# Altium project ADCAN.PrjPcb (part 1 of 3)
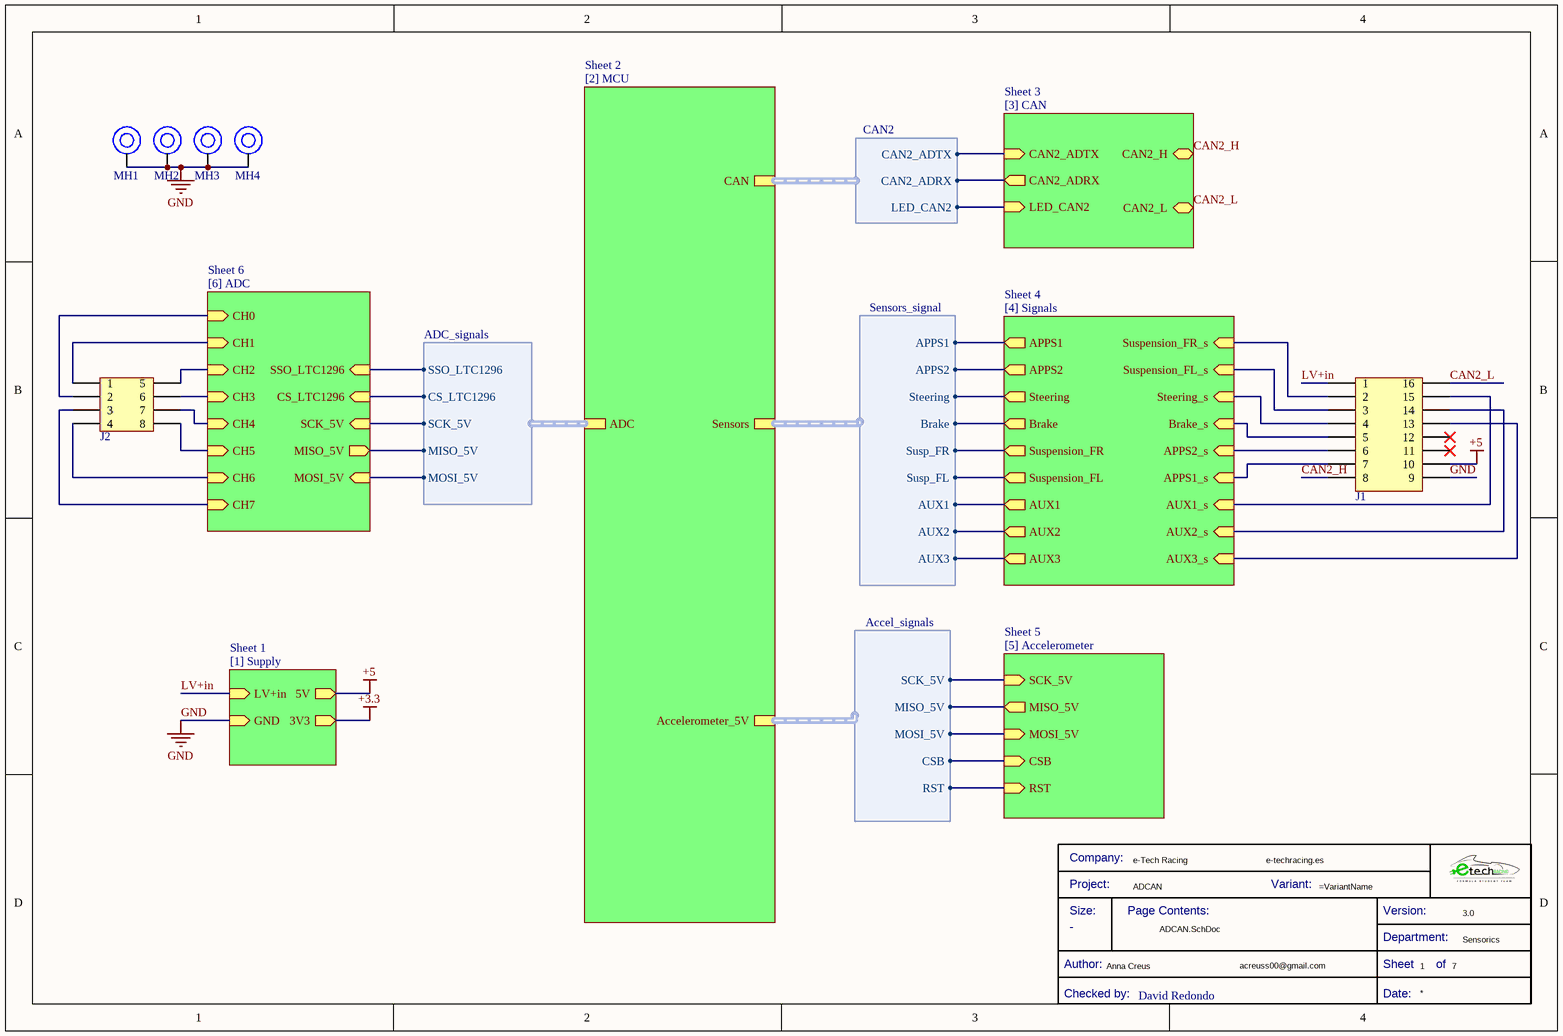
[diagram p0: ADCAN.SchDoc]
Company: e-Tech Racing; Department: Sensorics; DesignedByURL: e-techracing.es; DesignerMail: acreuss00@gmail.com; DesignerName: Anna Creus; Project: ADCAN; ReviewerName: David Redondo; Version: 3.0
7 sheets, 155 parts. Net scope: hierarchical (ports join the sheet entries above them; power ports are global).
Board file: ADCAN.PcbDoc
Sheets:
  ADCAN.SchDoc
    Sheet 2 = [2] MCU.SchDoc
    Sheet 1 = [1] Supply.SchDoc
    Sheet 3 = [3] CAN.SchDoc
    Sheet 4 = [4] Signals.SchDoc
    Sheet 5 = [5] Accelerometer.SchDoc
    Sheet 6 = [6] ADC.SchDoc

## Sheet ADCAN.SchDoc
size A4; DocumentNumber: 0; SheetNumber: 1; SheetTotal: 7

### Parts
(Parts that share a designator on the sheet are numbered #1, #2 ... from top to bottom, then left to right.)
*#1  Checked by:: David Redondo  (hidden comment: Title Block_template)  (graphical)
J1  1053141116  [J_NanoFit_2x8]  (value not drawn)
J2  105314-1108  [J_NanoFit_2X4]  (value not drawn)
MH1  Mounting_Hole_M3  [Mounting_Hole_M3]  (value not drawn)
MH2  Mounting_Hole_M3  [Mounting_Hole_M3]  (value not drawn)
MH3  Mounting_Hole_M3  [Mounting_Hole_M3]  (value not drawn)
MH4  Mounting_Hole_M3  [Mounting_Hole_M3]  (value not drawn)

### Sub-sheets
Sheet 1 = [1] Supply: 5V (out), 3V3 (out), LV+in (in), GND (in)
Sheet 2 = [2] MCU: CAN (harness CAN2), Sensors (harness Sensors_signal), Accelerometer_5V (harness Accel_signals), ADC (harness ADC_signals)
Sheet 3 = [3] CAN: CAN2_ADTX (in), CAN2_ADRX (out), LED_CAN2 (in), CAN2_H (bidir), CAN2_L (bidir)
Sheet 4 = [4] Signals: APPS1 (out), APPS2 (out), Steering (out), Brake (out), Suspension_FR (out), Suspension_FL (out), APPS1_s (in), APPS2_s (in), Brake_s (in), Steering_s (in), Suspension_FL_s (in), Suspension_FR_s (in), AUX1 (out), AUX2 (out), AUX1_s (in), AUX2_s (in), AUX3 (out), AUX3_s (in)
Sheet 5 = [5] Accelerometer: SCK_5V (in), MISO_5V (out), MOSI_5V (in), CSB (in), RST (in)
Sheet 6 = [6] ADC: SSO_LTC1296 (in), SCK_5V (in), CS_LTC1296 (in), CH0 (in), CH1 (in), CH2 (in), CH3 (in), CH4 (in), CH5 (in), CH6 (in), CH7 (in), MISO_5V (out), MOSI_5V (in)

### Harnesses
CAN2: CAN2_ADTX, CAN2_ADRX, LED_CAN2
Sensors_signal: APPS1, APPS2, Steering, Brake, Susp_FR, Susp_FL, AUX1, AUX2, AUX3
Accel_signals: SCK_5V, MISO_5V, MOSI_5V, CSB, RST
ADC_signals: SSO_LTC1296, CS_LTC1296, SCK_5V, MISO_5V, MOSI_5V

### Nets
+5: J1.10 ; sheet Sheet 1/5V
GND: J1.9 MH1.1 MH2.1 MH3.1 MH4.1 ; sheet Sheet 1/GND
APPS1: sheet Sheet 4/APPS1, sheet Sheet 2/Sensors.APPS1
APPS1_s: J1.7 ; sheet Sheet 4/APPS1_s
APPS2: sheet Sheet 4/APPS2, sheet Sheet 2/Sensors.APPS2
APPS2_s: J1.6 ; sheet Sheet 4/APPS2_s
AUX1: sheet Sheet 4/AUX1, sheet Sheet 2/Sensors.AUX1
AUX1_s: J1.15 ; sheet Sheet 4/AUX1_s
AUX2: sheet Sheet 4/AUX2, sheet Sheet 2/Sensors.AUX2
AUX2_s: J1.14 ; sheet Sheet 4/AUX2_s
AUX3: sheet Sheet 4/AUX3, sheet Sheet 2/Sensors.AUX3
AUX3_s: J1.13 ; sheet Sheet 4/AUX3_s
Brake: sheet Sheet 4/Brake, sheet Sheet 2/Sensors.Brake
Brake_s: J1.5 ; sheet Sheet 4/Brake_s
CAN2_ADRX: sheet Sheet 3/CAN2_ADRX, sheet Sheet 2/CAN.CAN2_ADRX
CAN2_ADTX: sheet Sheet 3/CAN2_ADTX, sheet Sheet 2/CAN.CAN2_ADTX
CAN2_H: J1.8 ; sheet Sheet 3/CAN2_H
CAN2_L: J1.16 ; sheet Sheet 3/CAN2_L
CS_LTC1296: sheet Sheet 6/CS_LTC1296, sheet Sheet 2/ADC.CS_LTC1296
CSB: sheet Sheet 5/CSB, sheet Sheet 2/Accelerometer_5V.CSB
LED_CAN2: sheet Sheet 3/LED_CAN2, sheet Sheet 2/CAN.LED_CAN2
LV+in: J1.1 ; sheet Sheet 1/LV+in
MISO_5V: sheet Sheet 5/MISO_5V, sheet Sheet 6/MISO_5V, sheet Sheet 2/Accelerometer_5V.MISO_5V, sheet Sheet 2/ADC.MISO_5V
MOSI_5V: sheet Sheet 5/MOSI_5V, sheet Sheet 6/MOSI_5V, sheet Sheet 2/Accelerometer_5V.MOSI_5V, sheet Sheet 2/ADC.MOSI_5V
RST: sheet Sheet 5/RST, sheet Sheet 2/Accelerometer_5V.RST
SCK_5V: sheet Sheet 5/SCK_5V, sheet Sheet 6/SCK_5V, sheet Sheet 2/Accelerometer_5V.SCK_5V, sheet Sheet 2/ADC.SCK_5V
SSO_LTC1296: sheet Sheet 6/SSO_LTC1296, sheet Sheet 2/ADC.SSO_LTC1296
Steering: sheet Sheet 4/Steering, sheet Sheet 2/Sensors.Steering
Steering_s: J1.4 ; sheet Sheet 4/Steering_s
SuspeFL_s: J1.3 ; sheet Sheet 4/Suspension_FL_s
SuspeFR_s: J1.2 ; sheet Sheet 4/Suspension_FR_s
Suspension_FL: sheet Sheet 4/Suspension_FL, sheet Sheet 2/Sensors.Susp_FL
Suspension_FR: sheet Sheet 4/Suspension_FR, sheet Sheet 2/Sensors.Susp_FR
NetJ2_1: J2.1 ; sheet Sheet 6/CH1
NetJ2_2: J2.2 ; sheet Sheet 6/CH0
NetJ2_3: J2.3 ; sheet Sheet 6/CH7
NetJ2_4: J2.4 ; sheet Sheet 6/CH6
NetJ2_5: J2.5 ; sheet Sheet 6/CH2
NetJ2_6: J2.6 ; sheet Sheet 6/CH3
NetJ2_7: J2.7 ; sheet Sheet 6/CH4
NetJ2_8: J2.8 ; sheet Sheet 6/CH5

Not connected (* = marked no-connect by the designer): J1 11* 12*

### Notes on the sheet
- (in symbol Title Block_template) Company:; Project:; Variant:; Size:; Page Contents:; Version:; Department:; Author:; Sheet; of; Checked by:; Date:

### Library data of the parts
*#1 = Title Block_template: Standard Title Block; .Creator: GP; Category: Title Block; .PCBcheck: GP; .SCHcheck: GP; Size: -
J1 = J_NanoFit_2x8: Nano-Fit Right Angle Header Through Hole 2.50mm Pitch Dual Row 16 Circuits Tin (Sn) Plating Black; Manufacturer: Molex; Manufacturer Part Number: 105314-1116; .Creator: DO; ComponentLink1URL: https://www.molex.com/pdm_docs/ps/PS-105300-100-001.pdf?src-supplier=Digi-Key; ComponentLink1Description: https://www.molex.com/pdm_docs/ps/PS-105300-100-001.pdf?src-supplier=Digi-Key; ComponentLink2Description: Where buy it; ComponentLink2URL: https://www.molex.com/molex/products/part-detail/pcb_headers/1053141116; Supplier 1: Newark; RoHS: Yes; Category: Headers and Wire Housings; Stock 1: 366; Pricing 1: 1=3,37000, 10=3,24000, 25=2,88000, 50=2,81000, 100=2,73000, 250=2,44000 (USD); Supplier Part Number 1: 33AC7692
J2 = J_NanoFit_2x4: Nano-Fit Right Angle Header Through Hole 2.50mm Pitch Dual Row 8 Circuits Tin (Sn) Plating Black; Manufacturer: Molex; Temperature rating: -40° to +105°C; Category type: PCB header; Maximum current: 7.5 A; Maximum voltage: 750 V AC; Connections: 2x4; Connector Type: Header,Male Pin; Number of Positions: 8; .Creator: DO; Category: Connector; ComponentLink1Description: Datasheet; ComponentLink1URL: https://www.molex.com/molex/products/part-detail/pcb_headers/1053141104; ComponentLink2Description: Where buy it; ComponentLink2URL: *; Manufacturer part number: 105314-1108; Supplier: *; RoHS: *; Application: Wire to board; Product name: Nano-Fit; Flammability: 94V-0; Orientation: Right Angle; Mount: Through hole; Supplier 1: Digi-Key; Stock 1: 11021; Pricing 1: 1=1,98000, 10=1,68600, 156=1,39308, 1092=1,09983, 4992=0,97518, 10140=0,95318 (USD); Contact Plating: Tin; Contact Material: Brass; Contact Shape: Square; Insulation Material: Polymer; Insulation Color: Black; Min Operating Temperature: -40°C; Max Operating Temperature: 105°C; Fastening Type: Latch; Packaging: Tray; Number of Rows: 2; Termination: Solder; RoHS Compliant: Yes; ComponentLink3URL: http://www.farnell.com/datasheets/2551096.pdf?src-supplier=Newark; ComponentLink3Description: http://www.farnell.com/datasheets/2551096.pdf?src-supplier=Newark; ComponentLink4URL: https://www.molex.com/pdm_docs/sd/1053141104_sd.pdf?src-supplier=Digi-Key; ComponentLink4Description: https://www.molex.com/pdm_docs/sd/1053141104_sd.pdf?src-supplier=Digi-Key; Supplier Part Number 1: WM16909-ND

## Sheet [2] MCU.SchDoc
size A4; SheetNumber: 3; SheetTotal: 6
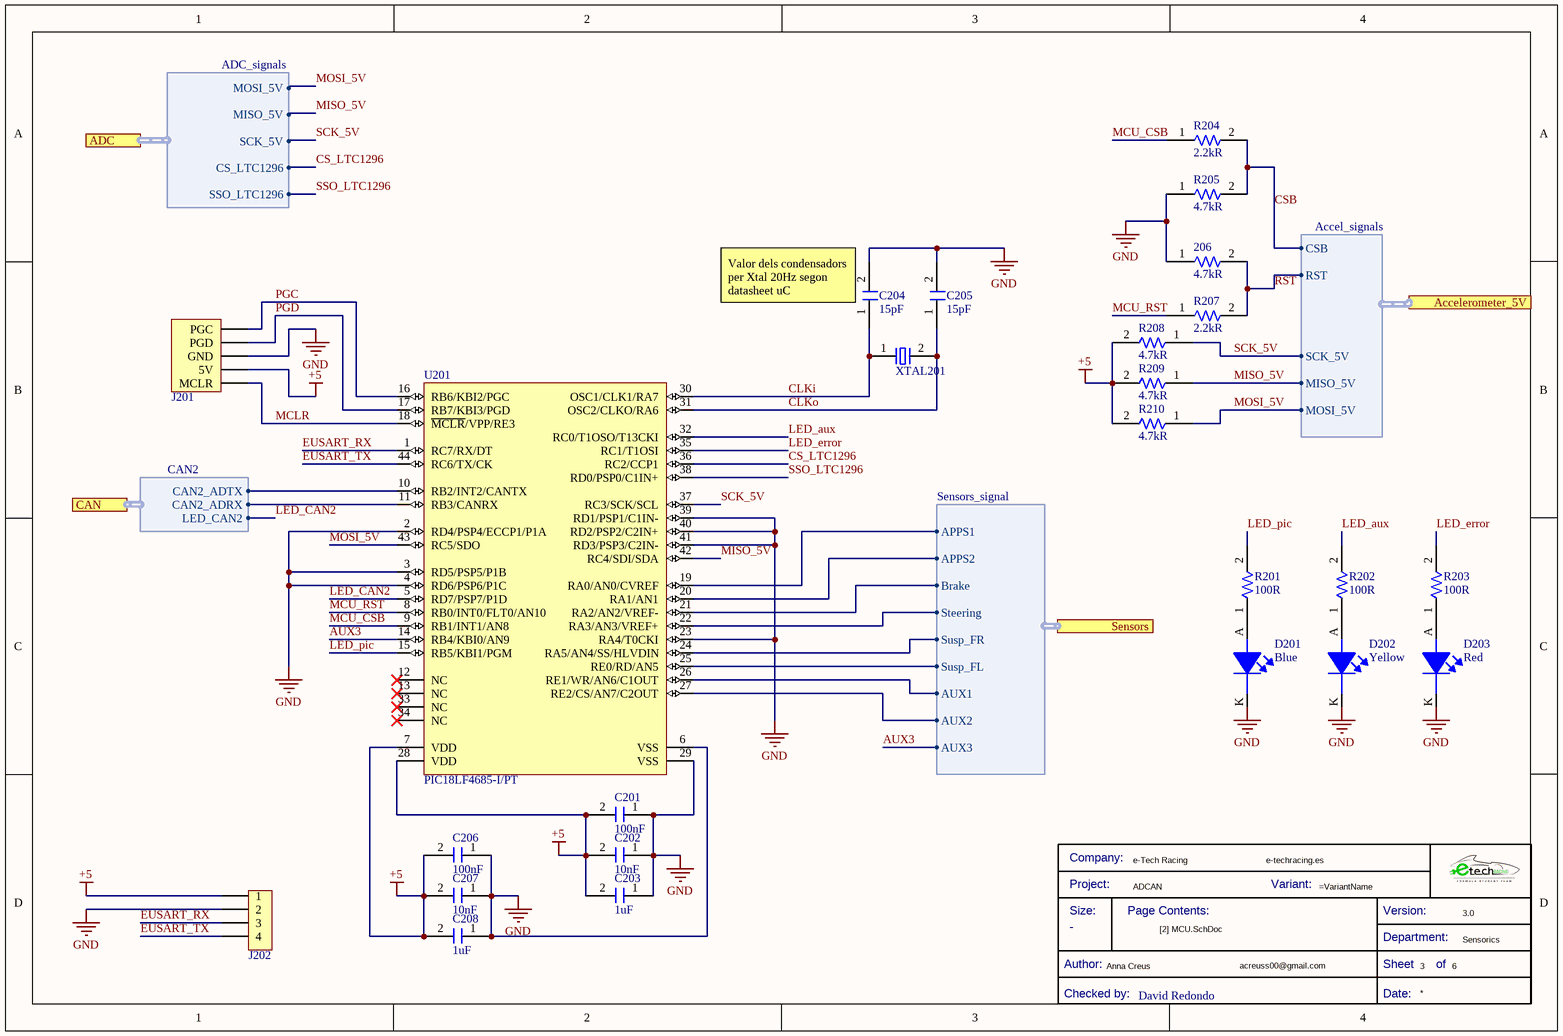
[diagram p1: [2] MCU.SchDoc]

### Parts
(Parts that share a designator on the sheet are numbered #1, #2 ... from top to bottom, then left to right.)
206  Resistance: 4.7kR  [R1206FTK-W]  (hidden comment: CRS1206-FX-4701ELF)
*#2  Checked by:: David Redondo  (hidden comment: Title Block_template)  (graphical)
C201  Capacitance: 100nF  [C1206FNPC-RW]  (hidden comment: 885012208009)
C202  Capacitance: 10nF  [C1206FNPC-RW]  (hidden comment: 885012208009)
C203  Capacitance: 1uF  [C1206FNPC-RW]  (hidden comment: 885012208009)
C204  Capacitance: 15pF  [C1206FNPC-RW]  (hidden comment: 885012008038)
C205  Capacitance: 15pF  [C1206FNPC-RW]  (hidden comment: 885012008038)
C206  Capacitance: 100nF  [C1206FNPC-RW]  (hidden comment: 885012208009)
C207  Capacitance: 10nF  [C1206FNPC-RW]  (hidden comment: 885012208009)
C208  Capacitance: 1uF  [C1206FNPC-RW]  (hidden comment: 885012208009)
D201  Color: Blue  [LED_1206_WE]  (hidden comment: 150120BS75000)
D202  Color: Yellow  [LED_1206_WE]  (hidden comment: 150120YS75000)
D203  Color: Red  [LED_1206_WE]  (hidden comment: 150120RS75000)
J201  61300511121  [J_Pinheader_1x5]  (value not drawn)
J202  61300411121  [J_PinHeader_1x4]  (value not drawn)
R201  Resistance: 100R  [R1206FTK-W]  (hidden comment: CRG1206F100R)
R202  Resistance: 100R  [R1206FTK-W]  (hidden comment: CRG1206F100R)
R203  Resistance: 100R  [R1206FTK-W]  (hidden comment: CRG1206F100R)
R204  Resistance: 2.2kR  [R1206FTK-W]  (hidden comment: CR1206-FX-2201ELF)
R205  Resistance: 4.7kR  [R1206FTK-W]  (hidden comment: CRS1206-FX-4701ELF)
R207  Resistance: 2.2kR  [R1206FTK-W]  (hidden comment: CR1206-FX-2201ELF)
R208  Resistance: 4.7kR  [R1206FTK-W]  (hidden comment: CRS1206-FX-4701ELF)
R209  Resistance: 4.7kR  [R1206FTK-W]  (hidden comment: CRS1206-FX-4701ELF)
R210  Resistance: 4.7kR  [R1206FTK-W]  (hidden comment: CRS1206-FX-4701ELF)
U201  PIC18LF4685-I/PT  [U_PIC18LF4685-I/PT]
XTAL201  830028710  [XTAL20M_SMD]  (value not drawn)

### Ports
Accelerometer_5V (harness Accel_signals), ADC (harness ADC_signals), CAN (harness CAN2), Sensors (harness Sensors_signal)

### Harnesses
Accel_signals: CSB, MISO_5V, MOSI_5V, RST, SCK_5V
Sensors_signal: APPS1, APPS2, Susp_FR, Susp_FL, Brake, Steering, AUX1, AUX2, AUX3
CAN2: CAN2_ADRX, CAN2_ADTX, LED_CAN2
ADC_signals: SSO_LTC1296, CS_LTC1296, SCK_5V, MISO_5V, MOSI_5V

### Nets
+5: C201.2 C202.2 C203.2 C206.2 C207.2 C208.2 J201.2(5V) J202.1 R208.2 R209.2 R210.2 U201.7(VDD) U201.28(VDD)
GND: 206.1 C201.1 C202.1 C203.1 C204.2 C205.2 C206.1 C207.1 C208.1 D201.K D202.K D203.K J201.3(GND) J202.2 R205.1 U201.2(RD4/PSP4/ECCP1/P1A) U201.3(RD5/PSP5/P1B) U201.4(RD6/PSP6/P1C) U201.6(VSS) U201.23(RA4/T0CKI) U201.29(VSS) U201.39(RD1/PSP1/C1IN-) U201.40(RD2/PSP2/C2IN+) U201.41(RD3/PSP3/C2IN-)
APPS1: U201.19(RA0/AN0/CVREF) ; port Sensors.APPS1
APPS2: U201.20(RA1/AN1) ; port Sensors.APPS2
AUX1: U201.26(RE1/WR/AN6/C1OUT) ; port Sensors.AUX1
AUX2: U201.27(RE2/CS/AN7/C2OUT) ; port Sensors.AUX2
AUX3: U201.14(RB4/KBI0/AN9) ; port Sensors.AUX3
Brake: U201.21(RA2/AN2/VREF-) ; port Sensors.Brake
CAN2_ADRX: U201.11(RB3/CANRX) ; port CAN.CAN2_ADRX
CAN2_ADTX: U201.10(RB2/INT2/CANTX) ; port CAN.CAN2_ADTX
CLKi: C204.1 U201.30(OSC1/CLK1/RA7) XTAL201.1
CLKo: C205.1 U201.31(OSC2/CLKO/RA6) XTAL201.2
CS_LTC1296: U201.36(RC2/CCP1) ; port ADC.CS_LTC1296
CSB: R204.2 R205.2 ; port Accelerometer_5V.CSB
EUSART_RX: J202.3 U201.1(RC7/RX/DT)
EUSART_TX: J202.4 U201.44(RC6/TX/CK)
LED_aux: R202.2 U201.32(RC0/T1OSO/T13CKI)
LED_CAN2: U201.5(RD7/PSP7/P1D) ; port CAN.LED_CAN2
LED_error: R203.2 U201.35(RC1/T1OSI)
LED_pic: R201.2 U201.15(RB5/KBI1/PGM)
MCLR: J201.1(MCLR) U201.18(~{MCLR}/VPP/RE3)
MCU_CSB: R204.1 U201.9(RB1/INT1/AN8)
MCU_RST: R207.1 U201.8(RB0/INT0/FLT0/AN10)
MISO_5V: R209.1 U201.42(RC4/SDI/SDA) ; port Accelerometer_5V.MISO_5V, port ADC.MISO_5V
MOSI_5V: R210.1 U201.43(RC5/SDO) ; port Accelerometer_5V.MOSI_5V, port ADC.MOSI_5V
PGC: J201.5(PGC) U201.16(RB6/KBI2/PGC)
PGD: J201.4(PGD) U201.17(RB7/KBI3/PGD)
RST: 206.2 R207.2 ; port Accelerometer_5V.RST
SCK_5V: R208.1 U201.37(RC3/SCK/SCL) ; port Accelerometer_5V.SCK_5V, port ADC.SCK_5V
SSO_LTC1296: U201.38(RD0/PSP0/C1IN+) ; port ADC.SSO_LTC1296
Steering: U201.22(RA3/AN3/VREF+) ; port Sensors.Steering
Suspension_FL: U201.25(RE0/RD/AN5) ; port Sensors.Susp_FL
Suspension_FR: U201.24(RA5/AN4/SS/HLVDIN) ; port Sensors.Susp_FR
NetD201_A: D201.A R201.1
NetD202_A: D202.A R202.1
NetD203_A: D203.A R203.1

Not connected (* = marked no-connect by the designer): U201 12(NC)* 13(NC)* 33(NC)* 34(NC)*

### Notes on the sheet
- (near C204) Valor dels condensadors per Xtal 20Hz segon datasheet uC
- (in symbol Title Block_template) Company:; Project:; Variant:; Size:; Page Contents:; Version:; Department:; Author:; Sheet; of; Checked by:; Date:

### Library data of the parts
206 R205 R208-R210 = R4.7K-1206FTK: Res Thick Film 1206 4.7K Ohm 1% 1/2W ±100ppm/°C Molded SMD T/R; Manufacturer 1: Bourns JW Miller; Voltage Rating: 400V; Power Rating: 500mW; Supplier 1: Digi-Key; RoHS: Yes; Category: Chip SMD Resistors; Pricing 1: 1=0,42000, 10=0,35400, 100=0,13850, 1000=0,05796, 2500=0,05313 (USD); Mount: Surface Mount; Case/Package: 1206; Case Code (Metric): 3016; Case Code (Imperial): 1206; Min Operating Temperature: -55°C; Max Operating Temperature: 155°C; Packaging: Cut Tape; Resistor Type: Thick Film; Number of Terminations: 2; Termination: SMD/SMT; Working Voltage: 400V; Voltage Rating (DC): 400V; Tolerance: 1%; Max Power Dissipation: 500mW; Temperature Coefficient: 100ppm/°C; Length: 0.122inch; Width: 0.063inch; Height: 0.026inch; REACH SVHC: No SVHC; ComponentLink1URL: https://datasheet.ciiva.com/48986/70483705-48986735.pdf?src-supplier=Allied+Electronics; ComponentLink1Description: https://datasheet.ciiva.com/48986/70483705-48986735.pdf?src-supplier=Allied+Electronics; Supplier Part Number 1: CRS1206-FX-4701ELFCT-ND; ComponentLink3Description: RS; ComponentLink3URL: https://es.rs-online.com/web/p/resistencias-de-montaje-en-superficie/8672965; Manufacturer Part Number 1: CRS1206-FX-4701ELF
*#2 = Title Block_template: Standard Title Block; .Creator: GP; Category: Title Block; .PCBcheck: GP; .SCHcheck: GP; Size: -
C201-C203 C206-C208 = C100n-10V-1206FNPC-X7R: Cap, 0.1ΜF, 10V, 10%, X7R, 1206; Manufacturer 1: Wurth Electronics; Supplier 1: Digi-Key; Manufacturer Part Number 1: 885012208009; RoHS: Yes; Category: Ceramic Capacitors; Stock 1: 7198; Pricing 1: 1=0,11000, 10=0,10300, 100=0,09200, 500=0,08100 (USD); Mount: Surface Mount; Case/Package: 1206; Case Code (Metric): 3216; Case Code (Imperial): 1206; Min Operating Temperature: -55°C; Max Operating Temperature: 125°C; Packaging: Tape and Reel; Voltage Rating: 10V; Tolerance: 10%; Length: 0.126inch; Width: 0.063inch; Thickness: 0.035inch; RoHS Compliant: Yes; ComponentLink1URL: http://www.farnell.com/datasheets/2031891.pdf?src-supplier=Farnell; ComponentLink1Description: http://www.farnell.com/datasheets/2031891.pdf?src-supplier=Farnell; ComponentLink2URL: http://katalog.we-online.de/pbs/datasheet/885012208009.pdf?src-supplier=Digi-Key; ComponentLink2Description: http://katalog.we-online.de/pbs/datasheet/885012208009.pdf?src-supplier=Digi-Key; ComponentLink3URL: https://katalog.we-online.de/pbs/datasheet/885012208009.pdf?src-supplier=Digi-Key; ComponentLink3Description: https://katalog.we-online.de/pbs/datasheet/885012208009.pdf?src-supplier=Digi-Key; Supplier Part Number 1: 732-8086-1-ND; ComponentLink4Description: Wurth Elektronik; ComponentLink4URL: https://www.we-online.com/catalog/en/WCAP-CSGP-10VDC?sq=885012208009#885012208009
C204 C205 = C15p-50V-1206FNPC-NP0: Cap, 15Pf, 50V, 5%, C0G/np0, 1206 Rohs Compliant: Yes; Manufacturer: Wurth Electronics; Category: Capacitor; ComponentLink1Description: Datasheet; ComponentLink1URL: https://www.we-online.com/catalog/datasheet/885012008038.pdf; ComponentLink2Description: Where buy it; ComponentLink2URL: https://www.we-online.com/catalog/en/WCAP-CSGP-50VDC?sq=885012008038#885012008038; Supplier 1: Digi-Key; Manufacturer Part Number: 885012008038; RoHS: Yes; Stock 1: 6999; Pricing 1: 1=0,11000, 10=0,10000, 100=0,09000, 500=0,08000 (USD); Mount: Surface Mount; Case/Package: 1206; Case Code (Metric): 3216; Case Code (Imperial): 1206; Min Operating Temperature: -55°C; Max Operating Temperature: 125°C; Packaging: Tape and Reel; Voltage Rating: 50V; Tolerance: 5%; Length: 0.126inch; Width: 0.063inch; Thickness: 0.035inch; RoHS Compliant: Yes; ComponentLink3URL: http://www.farnell.com/datasheets/2546700.pdf?src-supplier=Farnell; ComponentLink3Description: http://www.farnell.com/datasheets/2546700.pdf?src-supplier=Farnell; ComponentLink4URL: https://katalog.we-online.de/pbs/datasheet/885012008038.pdf?src-supplier=Digi-Key; ComponentLink4Description: https://katalog.we-online.de/pbs/datasheet/885012008038.pdf?src-supplier=Digi-Key; Supplier Part Number 1: 732-7882-1-ND
D201 = LEDBS-1206-145: Led, Blue, 470 Nm, 3.2 V, 30 Ma, 145 Mcd Rohs Compliant: Yes; Manufacturer: Wurth Electronics; Luminous Intensity: 145mcd; Viewing Angle: 140°; Wavelength: 470nm; Forward Current: 30mA; Lens Style: Clear,Rectangular; Test Current: 20mA; Forward Voltage: 3.2V; Supplier 1: RSComponents; Manufacturer Part Number: 150120BS75000; RoHS: Yes; Category: LEDs; Stock 1: 1; Pricing 1: 50=0,23200, 500=0,16400, 750=0,15500, 1500=0,15000, 3000=0,14200 (USD); Mount: Surface Mount; Case/Package: 1206; Case Code (Metric): 3216; Case Code (Imperial): 1206; Min Operating Temperature: -40°C; Max Operating Temperature: 85°C; Package Quantity: 3000; Packaging: Tape and Reel; Dominant Wavelength: 470nm; Length: 3.2mm; Width: 1.6mm; Height: 0.68mm; REACH SVHC: Unknown; RoHS Compliant: Yes; ComponentLink1URL: https://datasheet.ciiva.com/22656/150120bs75000-22656976.pdf?src-supplier=Element14; ComponentLink1Description: https://datasheet.ciiva.com/22656/150120bs75000-22656976.pdf?src-supplier=Element14; ComponentLink2URL: https://datasheet.ciiva.com/29279/759440-da-01-en-chipled-1206-w-kl-blau-150120bs75000-29279045.pdf?src-supplier=Conrad; ComponentLink2Description: https://datasheet.ciiva.com/29279/759440-da-01-en-chipled-1206-w-kl-blau-150120bs75000-29279045.pdf?src-supplier=Conrad; ComponentLink3URL: https://datasheet.ciiva.com/29561/150120bs75000-29561882.pdf?src-supplier=Digi-Key; ComponentLink3Description: https://datasheet.ciiva.com/29561/150120bs75000-29561882.pdf?src-supplier=Digi-Key; Supplier Part Number 1: 8154243; ComponentLink4Description: Where buy it; ComponentLink4URL: https://www.we-online.com/catalog/en/WL-SMCW?sq=150120BS75000#150120BS75000
D202 = LEDYS-1206-120: Led, Yellow, 590 Nm, 2 V, 30 Ma, 120 Mcd Rohs Compliant: Yes; Manufacturer: Wurth Electronics; Wavelength: 590nm; Luminous Intensity: 120mcd; Forward Current: 30mA; Viewing Angle: 140°; Lens Style: Clear,Rectangular; Test Current: 20mA; Forward Voltage: 2V; Supplier 1: Newark; Manufacturer Part Number: 150120YS75000; RoHS: Yes; Category: LEDs; Stock 1: 7333; Pricing 1: 1=0,22700, 5=0,22700, 10=0,22100, 25=0,21300, 50=0,20700, 100=0,18200, 500=0,16200 (USD); Mount: Surface Mount; Case/Package: 1206; Case Code (Metric): 3216; Case Code (Imperial): 1206; Min Operating Temperature: -40°C; Max Operating Temperature: 85°C; Package Quantity: 3000; Packaging: Tape and Reel; Dominant Wavelength: 590nm; Length: 3.2mm; Width: 1.6mm; Height: 0.68mm; REACH SVHC: Unknown; RoHS Compliant: Yes; ComponentLink1URL: https://datasheet.ciiva.com/29561/150120ys75000-29561868.pdf?src-supplier=Digi-Key; ComponentLink1Description: https://datasheet.ciiva.com/29561/150120ys75000-29561868.pdf?src-supplier=Digi-Key; ComponentLink2URL: https://datasheet.ciiva.com/29279/759445-da-01-en-chipled-1206-w-kl-gelb-150120ys75000-29279074.pdf?src-supplier=Conrad; ComponentLink2Description: https://datasheet.ciiva.com/29279/759445-da-01-en-chipled-1206-w-kl-gelb-150120ys75000-29279074.pdf?src-supplier=Conrad; Supplier Part Number 1: 95W3811; ComponentLink3Description: Where buy it; ComponentLink3URL: https://www.we-online.com/catalog/en/WL-SMCW?sq=150120YS75000#150120YS75000
D203 = LEDRS-1206-150: Led, Red, 625 Nm, 2 V, 30 Ma, 150 Mcd Rohs Compliant: Yes; Manufacturer: Wurth Electronics; Viewing Angle: 140°; Lens Style: Clear,Rectangular; Luminous Intensity: 150mcd; Wavelength: 625nm; Forward Current: 30mA; Test Current: 20mA; Forward Voltage: 2V; Supplier 1: RSComponents; Manufacturer Part Number: 150120RS75000; RoHS: Yes; Category: LEDs; Stock 1: 1; Pricing 1: 50=0,23200, 500=0,16400, 750=0,15500, 1500=0,15000, 3000=0,14200 (USD); Mount: Surface Mount; Case/Package: 1206; Case Code (Metric): 3216; Case Code (Imperial): 1206; Min Operating Temperature: -40°C; Max Operating Temperature: 85°C; Package Quantity: 1; Packaging: Tape and Reel; Dominant Wavelength: 625nm; Length: 3.2mm; Width: 1.6mm; Height: 0.68mm; REACH SVHC: Unknown; RoHS Compliant: Yes; ComponentLink1URL: https://datasheet.ciiva.com/29561/150120rs75000-29561888.pdf?src-supplier=Digi-Key; ComponentLink1Description: https://datasheet.ciiva.com/29561/150120rs75000-29561888.pdf?src-supplier=Digi-Key; ComponentLink2URL: https://datasheet.ciiva.com/29279/759442-da-01-en-chipled-1206-w-kl-rot-150120rs75000-29279067.pdf?src-supplier=Conrad; ComponentLink2Description: https://datasheet.ciiva.com/29279/759442-da-01-en-chipled-1206-w-kl-rot-150120rs75000-29279067.pdf?src-supplier=Conrad; ComponentLink3URL: https://datasheet.ciiva.com/22656/1911465-22656982.pdf?src-supplier=Element14; ComponentLink3Description: https://datasheet.ciiva.com/22656/1911465-22656982.pdf?src-supplier=Element14; ComponentLink4URL: https://datasheet.ciiva.com/48430/150120rs75000-eng-tds-48430054.pdf?src-supplier=Distrelec; ComponentLink4Description: https://datasheet.ciiva.com/48430/150120rs75000-eng-tds-48430054.pdf?src-supplier=Distrelec; Supplier Part Number 1: 8154256P; ComponentLink5Description: Where buy it; ComponentLink5URL: https://www.we-online.com/catalog/en/WL-SMCW#/articles/WL-SMCW-1206
J201 = J_Bootloader_PIC_5V: THT Vertical Pin Header WR-PHD, Pitch 2.54 mm, Single Row, 5 pins; Manufacturer: Molex; Temperature rating: -40° to +105°C; Category type: PCB-PCB; Maximum current: 3 A; Maximum voltage: 250 V AC; Connections: 1x5; Number of Positions: 5; Gender: Male; Connector Type: Male Pin; Pitch: 0.1inch; Category: Connector; ComponentLink1Description: Datasheet; ComponentLink1URL: https://www.we-online.com/catalog/datasheet/61300511121.pdf; ComponentLink2Description: Where buy it; ComponentLink2URL: https://www.we-online.com/catalog/en/PHD_2_54_THT_PIN_HEADER_6130XX11121?sq=61300511121&sp=https%3A%2F%2Fwww.we-online.com%2Fweb%2Fen%2Fwuerth_elektronik%2Fsearchpage.php%3Fsearch%3D61300511121#61300511121; Manufacturer part number: 61300511121; Supplier: Würth Elektronik; RoHS: *; Application: Charge program; Product name: Pin Header; Flammability: 94V-0; Orientation: vertical; Mount: Through hole; Supplier 1: Mouser; Stock 1: 1878; Pricing 1: 1=0,26000, 10=0,21600, 25=0,18000, 50=0,15000, 100=0,13700, 1000=0,12400, 10000=0,12400 (USD); Contact Plating: Gold; Contact Material: Copper; Color: Black; Number of Rows: 1; Packaging: Bulk; Termination: Solder; Number of Contacts: 5; Contact Mating Length: 0.236inch; REACH SVHC: Unknown; Lead Free: Lead Free; ComponentLink3URL: http://www.farnell.com/cad/1737268.pdf?src-supplier=Element14; ComponentLink3Description: http://www.farnell.com/cad/1737268.pdf?src-supplier=Element14; ComponentLink4URL: https://katalog.we-online.de/em/datasheet/6130xx11121.pdf?src-supplier=Digi-Key; ComponentLink4Description: https://katalog.we-online.de/em/datasheet/6130xx11121.pdf?src-supplier=Digi-Key; Supplier Part Number 1: 710-61300511121
J202 = J_UART: CONN HEADER 4 POS 2.54; Manufacturer 1: Wurth Electronics; Number of Positions: 4; Gender: Male; Connector Type: Male Pin; Pitch: 0.1inch; .Creator: AC; Supplier 1: RSComponents; Manufacturer Part Number 1: 61300411121; RoHS: Yes; Category: Headers and Wire Housings; Stock 1: 1; Pricing 1: 5=0,19500, 250=0,08000, 500=0,07700, 2500=0,07500, 5000=0,07200 (USD); Mount: Through Hole; Contact Plating: Gold; Contact Material: Copper; Color: Black; Number of Rows: 1; Packaging: Bulk; Termination: Solder; Number of Contacts: 4; Contact Mating Length: 0.236inch; REACH SVHC: Unknown; Lead Free: Lead Free; RoHS Compliant: Yes; ComponentLink1URL: http://www.farnell.com/cad/1737268.pdf?src-supplier=Element14; ComponentLink1Description: http://www.farnell.com/cad/1737268.pdf?src-supplier=Element14; ComponentLink2URL: https://katalog.we-online.de/em/datasheet/6130xx11121.pdf?src-supplier=Digi-Key; ComponentLink2Description: https://katalog.we-online.de/em/datasheet/6130xx11121.pdf?src-supplier=Digi-Key; Supplier Part Number 1: 8281594
R201-R203 = R100-1206FTK: Res Thick Film 1206 100 Ohm 1% 0.25W(1/4W) ±200ppm/C Pad SMD T/R; Manufacturer: TE Connectivity; Temperature Coefficient: 200ppm/°C; Max Power Dissipation: 250mW; Voltage Rating: 200V; Number of Resistors: 1; Category: Resistor; ComponentLink1Description: Datasheet; ComponentLink1URL: https://docs.rs-online.com/7aab/0900766b815b7339.pdf; ComponentLink2Description: Where buy it; ComponentLink2URL: https://es.rs-online.com/web/p/resistencias-de-montaje-en-superficie/2232120; Supplier 1: Digi-Key; Manufacturer Part Number: CRG1206F100R; RoHS: Yes; Stock 1: 13476; Pricing 1: 1=0,10000, 10=0,07600, 100=0,02920, 1000=0,01285, 2500=0,01110 (USD); Mount: Surface Mount; Case/Package: 1206; Case Code (Imperial): 1206; Case Code (Metric): 3216; Weight: 0.000571oz; Min Operating Temperature: -55°C; Max Operating Temperature: 125°C; Tolerance: 1%; Resistor Type: Thick Film; Packaging: Tape and Reel; Package Quantity: 5000; Number of Terminations: 2; Series: CRG, Neohm; Power Rating: 250mW; Termination: Solder; Technology: THICK FILM; Length: 3.1mm; Width: 1.55mm; Height: 0.55mm; Depth: 1.55mm; Radiation Hardening: No; RoHS Compliant: Yes; ELV: Compliant; ComponentLink3URL: https://datasheet.ciiva.com/11808/0900766b800a696e-11808648.pdf?src-supplier=RSComponents; ComponentLink3Description: https://datasheet.ciiva.com/11808/0900766b800a696e-11808648.pdf?src-supplier=RSComponents; ComponentLink4URL: https://datasheet.ciiva.com/16763/70063020-16763547.pdf?src-supplier=Allied+Electronics; ComponentLink4Description: https://datasheet.ciiva.com/16763/70063020-16763547.pdf?src-supplier=Allied+Electronics; ComponentLink5URL: https://datasheet.ciiva.com/5562/eng-ds-1773204-g-5562604.pdf?src-supplier=Mouser; ComponentLink5Description: https://datasheet.ciiva.com/5562/eng-ds-1773204-g-5562604.pdf?src-supplier=Mouser; Supplier Part Number 1: A106068CT-ND
R204 R207 = R2.2K-1206FTK: Res Thick Film 1206 2.2K Ohm 1% 1/4W ±100ppm/°C Molded SMD SMD Paper Tape on Plastic Reel; Manufacturer 1: Bourns; Power Rating: 250mW; Voltage Rating: 200V; Supplier 1: Digi-Key; Manufacturer Part Number 1: CR1206-FX-2201ELF; RoHS: Yes; Category: Chip SMD Resistors; Stock 1: 150; Pricing 1: 1=0,10000, 10=0,04200, 100=0,01700, 1000=0,00762, 2500=0,00661 (USD); Mount: Surface Mount; Case/Package: 1206; Number of Pins: 2; Contact Plating: Tin; Case Code (Metric): 3216; Case Code (Imperial): 1206; Min Operating Temperature: -55°C; Max Operating Temperature: 155°C; Tolerance: 1%; Resistor Type: Thick Film; Temperature Coefficient: 100ppm/°C; Packaging: Tape and Reel; Package Quantity: 5000; Number of Terminations: 2; Termination: SMD/SMT; Max Power Dissipation: 250mW; Voltage Rating (DC): 200V; Features: Moisture Resistant; Series: CR1206; Resistance Tolerance: 1%; Construction: Rectangular; Technology: THICK FILM; Length: 3.2mm; Width: 1.6mm; Height: 0.6mm; Depth: 1.6mm; Thickness: 610um; Radiation Hardening: No; REACH SVHC: No SVHC; Military Standard: Not; RoHS Compliant: Yes; ComponentLink1URL: https://datasheet.ciiva.com/11809/0900766b80fcdb72-11809898.pdf?src-supplier=RSComponents; ComponentLink1Description: https://datasheet.ciiva.com/11809/0900766b80fcdb72-11809898.pdf?src-supplier=RSComponents; ComponentLink2URL: https://datasheet.ciiva.com/9123/chpreztr-9123227.pdf?src-supplier=Avnet; ComponentLink2Description: https://datasheet.ciiva.com/9123/chpreztr-9123227.pdf?src-supplier=Avnet; ComponentLink3URL: https://datasheet.ciiva.com/16770/70154685-16770447.pdf?src-supplier=Allied+Electronics; ComponentLink3Description: https://datasheet.ciiva.com/16770/70154685-16770447.pdf?src-supplier=Allied+Electronics; ComponentLink4URL: https://datasheet.ciiva.com/7985/1856384-7985879.pdf?src-supplier=Element14; ComponentLink4Description: https://datasheet.ciiva.com/7985/1856384-7985879.pdf?src-supplier=Element14; ComponentLink5URL: https://datasheet.ciiva.com/22693/1902866-22693258.pdf?src-supplier=Element14; ComponentLink5Description: https://datasheet.ciiva.com/22693/1902866-22693258.pdf?src-supplier=Element14; Supplier Part Number 1: CR1206-FX-2201ELFCT-ND; ComponentLink6Description: RS; ComponentLink6URL: https://es.rs-online.com/web/p/resistencias-fijas-para-montaje-en-superficie/7409097/
U201 = U_PIC18LF4685-I/PT_1: PIC18 Series 96 kB Flash 3328 B RAM 40 MHz 8-Bit Microcontroller - TQFP-44; Manufacturer 1: Microchip; Interface: I2C,SPI,CAN,UART,USART; Number of I/Os: 36; Number of Timers/Counters: 4; Max Supply Voltage: 5.5V; Min Supply Voltage: 2V; RAM Size: 3.25KB; Max Power Dissipation: 1W; Frequency: 40MHz; Data Bus Width: 8b; Number of Programmable I/O: 44; Oscillator Type: Internal; Number of ADC Channels: 11; Number of SPI Channels: 1; Watchdog Timer: Yes; Memory Size: 96KB; Access Time: 40us; Peripherals: PWM,I2C,Brown-out Detect/Reset,POR,WDT,HLVD; Core Architecture: PIC; .Creator: GP; Manufacturer Part Number 1: PIC18LF4685-I/PT; RoHS: Yes; Mount: SMD; Case/Package: TQFP; Number of Pins: 44; Min Operating Temperature: -40°C; Max Operating Temperature: 85°C; Packaging: Tray; Max Frequency: 40MHz; Number of I2C Channels: 1; Memory Type: FLASH; Number of UART Channels: 1; REACH SVHC: No SVHC; Category: Microcontroller; ComponentLink1Description: Datasheet; ComponentLink1URL: https://ww1.microchip.com/downloads/en/DeviceDoc/39761c.pdf; ComponentLink2Description: Where by it; ComponentLink2URL: *; Supplier 1: RSComponents; Manufacturer: Microchip; Manufacturer Part Number: PIC18LF4685-I/PT; Stock 1: 1; Pricing 1: 1=16,58200, 10=16,21700, 25=15,82500, 100=15,41900 (USD); Package Quantity: 160; Length: 10mm; Width: 10mm; Height: 1.05mm; Radiation Hardening: No; Lead Free: Lead Free; RoHS Compliant: Yes; ComponentLink3URL: https://datasheet.ciiva.com/9230/jp026433-9230074.pdf?src-supplier=Avnet; ComponentLink3Description: https://datasheet.ciiva.com/9230/jp026433-9230074.pdf?src-supplier=Avnet; ComponentLink4URL: https://datasheet.ciiva.com/22671/721078-22671516.pdf?src-supplier=Element14; ComponentLink4Description: https://datasheet.ciiva.com/22671/721078-22671516.pdf?src-supplier=Element14; ComponentLink5URL: https://datasheet.ciiva.com/6656/39761c-6656155.pdf?src-supplier=Digi-Key; ComponentLink5Description: https://datasheet.ciiva.com/6656/39761c-6656155.pdf?src-supplier=Digi-Key; ComponentLink6URL: https://datasheet.ciiva.com/16356/39761c-16356555.pdf?src-supplier=Future+Electronics; ComponentLink6Description: https://datasheet.ciiva.com/16356/39761c-16356555.pdf?src-supplier=Future+Electronics; ComponentLink7URL: https://datasheet.ciiva.com/41454/001084550-da-01-en-ic-pic-mcu-pic18lf4685-i-pt-tqfp-44-mcp-41454204.pdf?src-supplier=Conrad; ComponentLink7Description: https://datasheet.ciiva.com/41454/001084550-da-01-en-ic-pic-mcu-pic18lf4685-i-pt-tqfp-44-mcp-41454204.pdf?src-supplier=Conrad; Supplier Part Number 1: 8231075P
XTAL201 = XTAL20M_SMD: 830028710, 20 MHz; Manufacturer: Würth Elektronik; Frequency: 20 MHz; Frequency Stability: +-50 ppm; Drive level: 500µW max; Category: XTAL; ComponentLink1Description: Datasheet; ComponentLink1URL: https://www.we-online.com/catalog/datasheet/830028710.pdf; ComponentLink2Description: Where buy it; Package: *; Manufacturer part number: 830028710; Supplier: Würth Elektronik; Packaging: Reel; Max operating temperature.: 85ºC; Min operating temperature: -40ºC; Max power dissipation: *; Power rating: *; RoHS: Yes; Number of pins: 2; Type: SMD; Supplier 1: Digi-Key; Stock 1: 975; Pricing 1: 1=0,37000, 10=0,28100, 50=0,26800, 100=0,24400, 500=0,22000 (USD); Supplier Part Number 1: 1923-830028710CT-ND